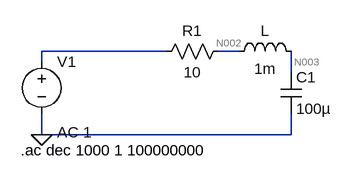
[diagram p0: schematic Draft1.asc]
Draft1.asc, the LTspice schematic file:
Version 4.1
SHEET 1 880 680
WIRE 144 96 -48 96
WIRE 256 96 224 96
WIRE -48 112 -48 96
WIRE 336 128 336 96
WIRE -48 224 -48 192
WIRE 336 224 336 192
WIRE 336 224 -48 224
FLAG -48 224 0
SYMBOL res 240 80 R90
WINDOW 0 0 56 VBottom 2
WINDOW 3 32 56 VTop 2
SYMATTR InstName R1
SYMATTR Value 10
SYMBOL ind 240 112 R270
WINDOW 0 32 56 VTop 2
WINDOW 3 5 56 VBottom 2
SYMATTR InstName L
SYMATTR Value 1m
SYMBOL cap 320 128 R0
SYMATTR InstName C1
SYMATTR Value 100µ
SYMBOL voltage -48 96 R0
WINDOW 123 24 124 Left 2
WINDOW 39 0 0 Left 0
SYMATTR Value2 AC 1
SYMATTR InstName V1
SYMATTR Value ""
TEXT -80 248 Left 2 !.ac dec 1000 1 100000000

The netlist it stands for:
* Draft1.asc
R1 N002 N001 10
L N002 N003 1m
C1 N003 0 100µ
V1 N001 0 AC 1
.ac dec 1000 1 100000000
.backanno
.end

* Results of the author's LTspice run, read from the files saved beside the schematic
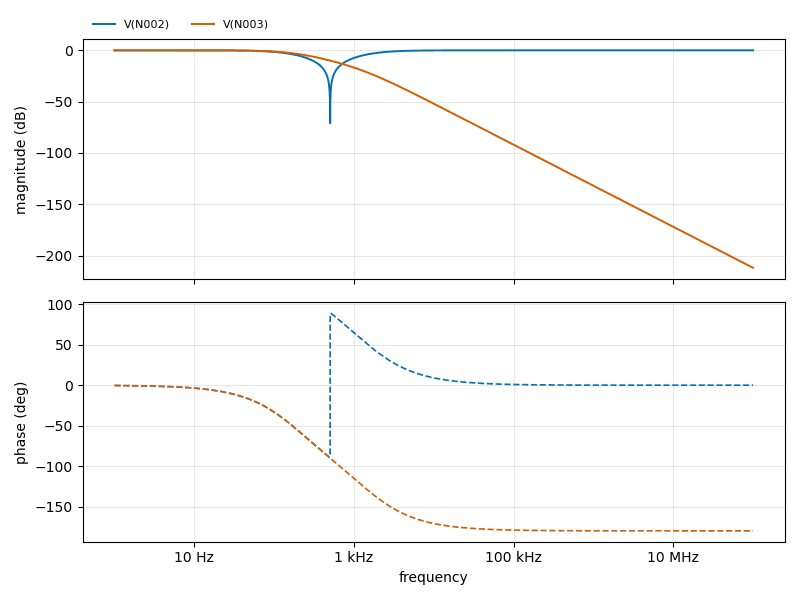
[diagram p1: AC Analysis of Draft1.asc, plotted from the saved traces]
* AC Analysis, 1 run:
*   V(N002): -0.00 dB at 1 Hz, -0.00 dB at 100 MHz, peak -0.00 dB at 100 MHz, 3 dB below the peak at 1.737 kHz
*   V(N003): -0.00 dB at 1 Hz, -211.93 dB at 100 MHz, peak -0.00 dB at 1 Hz, 3 dB below the peak at 176.6 Hz